# Altium schematic sheet Neon-Demon-Earing-revB.SchDoc
size A4; SheetNumber: 1; SheetTotal: 1
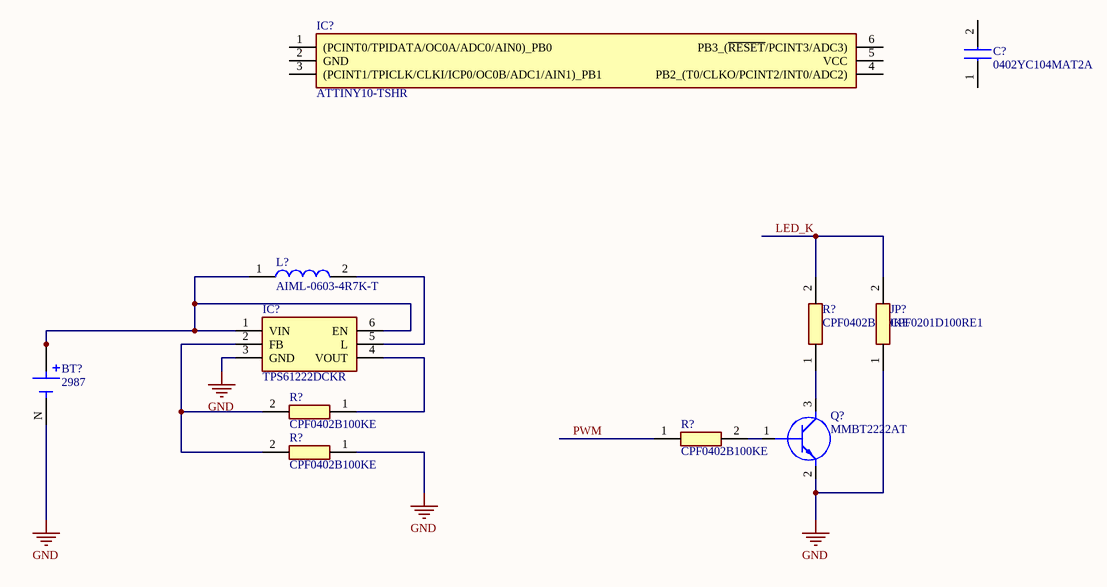
[diagram p0: Neon-Demon-Earing-revB.SchDoc]

## Parts
(Parts that share a designator on the sheet are numbered #1, #2 ... from top to bottom, then left to right.)
BT?  2987  [BAT_2987]
C?  0402YC104MAT2A  [CAPC1005X56N]
IC?#1  ATTINY10-TSHR  [SOT95P280X145-6N]
IC?#2  TPS61222DCKR  [SOT65P210X110-6N]
JP?  CPF0201D100RE1  [RESC0603X28N]
L?  AIML-0603-4R7K-T  [INDC1608X95N]
Q?  MMBT2222AT  [SOTFL50P160X78-3N]
R?#1  CPF0402B100KE  [RESC1005X35N]
R?#2  CPF0402B100KE  [RESC1005X35N]
R?#3  CPF0402B100KE  [RESC1005X35N]
R?#4  CPF0402B100KE  [RESC1005X35N]

## Nets
GND: BT?.N(NEG) IC?#2.3(GND) JP?.1 Q?.2(E) R?#4.1
LED_K: JP?.2 R?#1.2
PWM: R?#3.1
NetBT?_P1: BT?.P1(POS) BT?.P2(POS) IC?#2.1(VIN) IC?#2.6(EN) L?.1
NetIC?#2_2: IC?#2.2(FB) R?#2.2 R?#4.2
NetIC?#2_4: IC?#2.4(VOUT) R?#2.1
NetIC?#2_5: IC?#2.5(L) L?.2
NetQ?_1: Q?.1(B) R?#3.2
NetQ?_3: Q?.3(C) R?#1.1

Not connected (* = marked no-connect by the designer): C? 1 2; IC?#1 1((PCINT0/TPIDATA/OC0A/ADC0/AIN0)_PB0) 2(GND) 3((PCINT1/TPICLK/CLKI/ICP0/OC0B/ADC1/AIN1)_PB1) 4(PB2_(T0/CLKO/PCINT2/INT0/ADC2)) 5(VCC) 6(PB3_(~{RESET}/PCINT3/ADC3))

## Library data of the parts
C? = 0402YC104MAT2A: Capacitor; Manufacturer_Name: AVX; Datasheet Link: http://www.mouser.com/catalog/supplier/library/pdf/AVXSurfaceMountCeramic.pdf; Height: 0.56mm; Manufacturer_Part_Number: 0402YC104MAT2A; Mouser Part Number: 581-0402YC104MAT2A; Mouser Price/Stock: https://www.mouser.co.uk/ProductDetail/AVX/0402YC104MAT2A?qs=O2%2FeDh0sX9yiCaLwpXy1bw%3D%3D
IC?#1 = ATTINY10-TSHR: Integrated Circuit; Manufacturer_Name: Microchip; Datasheet Link: http://www.atmel.com/images/atmel-8127-avr-8-bit-microcontroller-attiny4-attiny5-attiny9-attiny10_datasheet.pdf; Height: 1.45mm; Manufacturer_Part_Number: ATTINY10-TSHR; Mouser Part Number: 556-ATTINY10-TSHR; Mouser Price/Stock: https://www.mouser.co.uk/ProductDetail/Microchip-Technology/ATTINY10-TSHR?qs=3unH%2FDqlvl%2FoduNsVj6acA%3D%3D; Arrow Part Number: ATTINY10-TSHR; Arrow Price/Stock: https://www.arrow.com/en/products/attiny10-tshr/microchip-technology?region=nac
IC?#2 = TPS61222DCKR: Integrated Circuit; Manufacturer_Name: Texas Instruments; Datasheet Link: https://www.ti.com/lit/gpn/TPS61222; Height: 1.1mm; Manufacturer_Part_Number: TPS61222DCKR; Mouser Part Number: 595-TPS61222DCKR; Mouser Price/Stock: https://www.mouser.co.uk/ProductDetail/Texas-Instruments/TPS61222DCKR?qs=IDSsxkoac0xpx0kmXXJcTA%3D%3D; Arrow Part Number: TPS61222DCKR; Arrow Price/Stock: https://www.arrow.com/en/products/tps61222dckr/texas-instruments?region=nac
JP? = CPF0201D100RE1: Resistor; Manufacturer_Name: TE Connectivity; Datasheet Link: http://www.te.com/commerce/DocumentDelivery/DDEController?Action=showdoc&DocId=Data+Sheet%7F1773200-1%7FA%7Fpdf%7FEnglish%7FENG_DS_1773200-1_A.pdf%7F4-2176215-6; Height: 0.28mm; Manufacturer_Part_Number: CPF0201D100RE1; Mouser Part Number: 279-CPF0201D100RE1; Mouser Price/Stock: https://www.mouser.co.uk/ProductDetail/TE-Connectivity-Holsworthy/CPF0201D100RE1?qs=gt1LBUVyoHlmoWock10t3Q%3D%3D; Arrow Part Number: CPF0201D100RE1; Arrow Price/Stock: https://www.arrow.com/en/products/cpf0201d100re1/te-connectivity?region=nac
L? = AIML-0603-4R7K-T: Inductor; Manufacturer_Name: ABRACON; Datasheet Link: https://abracon.com/Magnetics/new/AIML-0603.pdf; Height: 0.95mm; Manufacturer_Part_Number: AIML-0603-4R7K-T; Mouser Part Number: 815-AIML-0603-4R7KT; Mouser Price/Stock: https://www.mouser.co.uk/ProductDetail/ABRACON/AIML-0603-4R7K-T?qs=1vO2EIVe%252BY6wRO9cxMI0hw%3D%3D; Arrow Part Number: AIML-0603-4R7K-T; Arrow Price/Stock: https://www.arrow.com/en/products/aiml-0603-4r7k-t/abracon?region=nac
Q? = MMBT2222AT: Transistor BJT NPN; Manufacturer_Name: onsemi; Datasheet Link: http://www.onsemi.com/pub/Collateral/MMBT2222ATT1-D.PDF; Height: 0.78mm; Manufacturer_Part_Number: MMBT2222AT; Mouser Part Number: 512-MMBT2222AT; Mouser Price/Stock: https://www.mouser.co.uk/ProductDetail/ON-Semiconductor-Fairchild/MMBT2222AT/?qs=olBtUnqRSekpPcGAXqyohQ%3D%3D; Arrow Part Number: MMBT2222AT; Arrow Price/Stock: https://www.arrow.com/en/products/mmbt2222at/on-semiconductor
R?#1-R?#4 = CPF0402B100KE: Resistor; Manufacturer_Name: TE Connectivity; Datasheet Link: http://www.farnell.com/datasheets/1786775.pdf; Height: 0.35mm; Manufacturer_Part_Number: CPF0402B100KE; Mouser Part Number: 279-CPF0402B100KE; Mouser Price/Stock: https://www.mouser.co.uk/ProductDetail/TE-Connectivity-Holsworthy/CPF0402B100KE?qs=CXI0wBT1M2h4W2Gm72yIGA%3D%3D; Arrow Part Number: CPF0402B100KE; Arrow Price/Stock: https://www.arrow.com/en/products/cpf0402b100ke/te-connectivity?region=nac
BT? = 2987: Package: None; Price: None; Value: *; MP: 2987; Availability: Unavailable